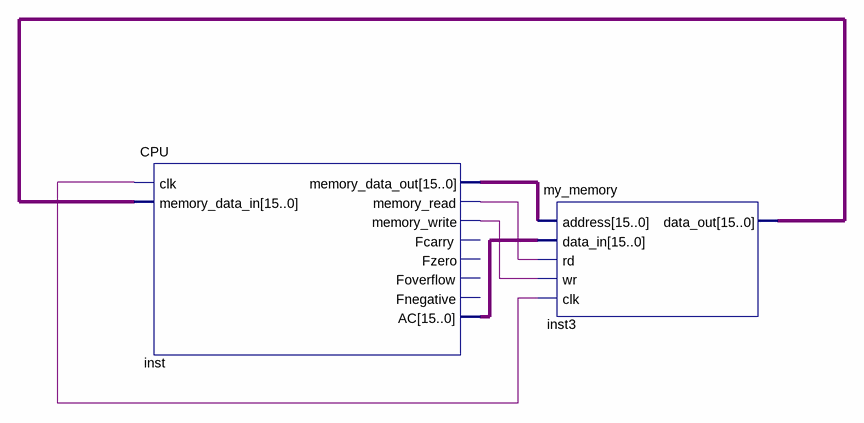
[diagram p0: schematic sheet]
// Quartus schematic orga.bdf as structural Verilog: 2 symbols, 0 pins
module orga (
);

  wire inst_memory_read, inst_memory_write, undriven;
  wire [15:0] inst3_data_out, inst_ac, inst_memory_data_out;

  CPU inst (
    .clk(undriven), .memory_data_in(inst3_data_out), .memory_data_out(inst_memory_data_out),
    .memory_read(inst_memory_read), .memory_write(inst_memory_write), .AC(inst_ac));  // open: Fcarry, Fzero, Foverflow, Fnegative
  my_memory inst3 (
    .address(inst_memory_data_out), .data_in(inst_ac), .rd(inst_memory_read), .wr(inst_memory_write),
    .clk(undriven), .data_out(inst3_data_out));
endmodule
